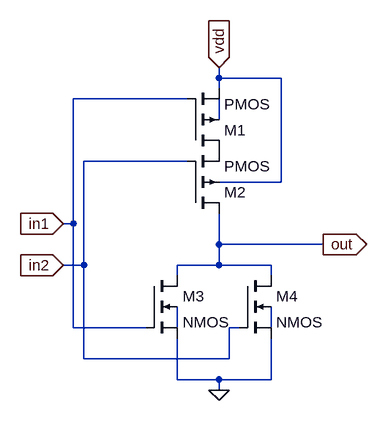
[diagram p0: schematic nor.asc]
nor.asc, the LTspice schematic file:
Version 4
SHEET 1 880 680
WIRE 288 -128 288 -144
WIRE 384 -128 288 -128
WIRE 288 -112 288 -128
WIRE 240 -96 64 -96
WIRE 288 -64 288 -96
WIRE 240 0 80 0
WIRE 384 32 384 -128
WIRE 384 32 288 32
WIRE 64 96 64 -96
WIRE 64 96 48 96
WIRE 288 128 288 80
WIRE 448 128 288 128
WIRE 80 160 80 0
WIRE 80 160 48 160
WIRE 288 160 288 128
WIRE 288 160 224 160
WIRE 368 160 288 160
WIRE 224 176 224 160
WIRE 368 176 368 160
WIRE 64 256 64 96
WIRE 176 256 64 256
WIRE 224 256 224 224
WIRE 320 256 304 256
WIRE 368 256 368 224
WIRE 80 304 80 160
WIRE 304 304 304 256
WIRE 304 304 80 304
WIRE 224 336 224 272
WIRE 288 336 224 336
WIRE 368 336 368 272
WIRE 368 336 288 336
WIRE 288 352 288 336
FLAG 48 96 in1
IOPIN 48 96 In
FLAG 48 160 in2
IOPIN 48 160 In
FLAG 448 128 out
IOPIN 448 128 Out
FLAG 288 -144 vdd
IOPIN 288 -144 In
FLAG 288 352 0
SYMBOL pmos4 240 -16 M180
SYMATTR InstName M1
SYMATTR Value2 l=90n w=400n
SYMBOL pmos4 240 80 M180
SYMATTR InstName M2
SYMATTR Value2 l=90n w=400n
SYMBOL nmos4 176 176 R0
SYMATTR InstName M3
SYMATTR Value2 l=90n w=200n
SYMBOL nmos4 320 176 R0
SYMATTR InstName M4
SYMATTR Value2 l=90n w=200n

The netlist it stands for:
* nor.asc
M1 P001 in1 vdd N001 PMOS l=90n w=400n
M2 out in2 P001 vdd PMOS l=90n w=400n
M3 out in1 0 N002 NMOS l=90n w=200n
M4 out in2 0 N003 NMOS l=90n w=200n
.model NMOS NMOS
.model PMOS PMOS
.lib standard.mos
.backanno
.end